# EAGLE schematic se8 (EAGLE 6.5.0)
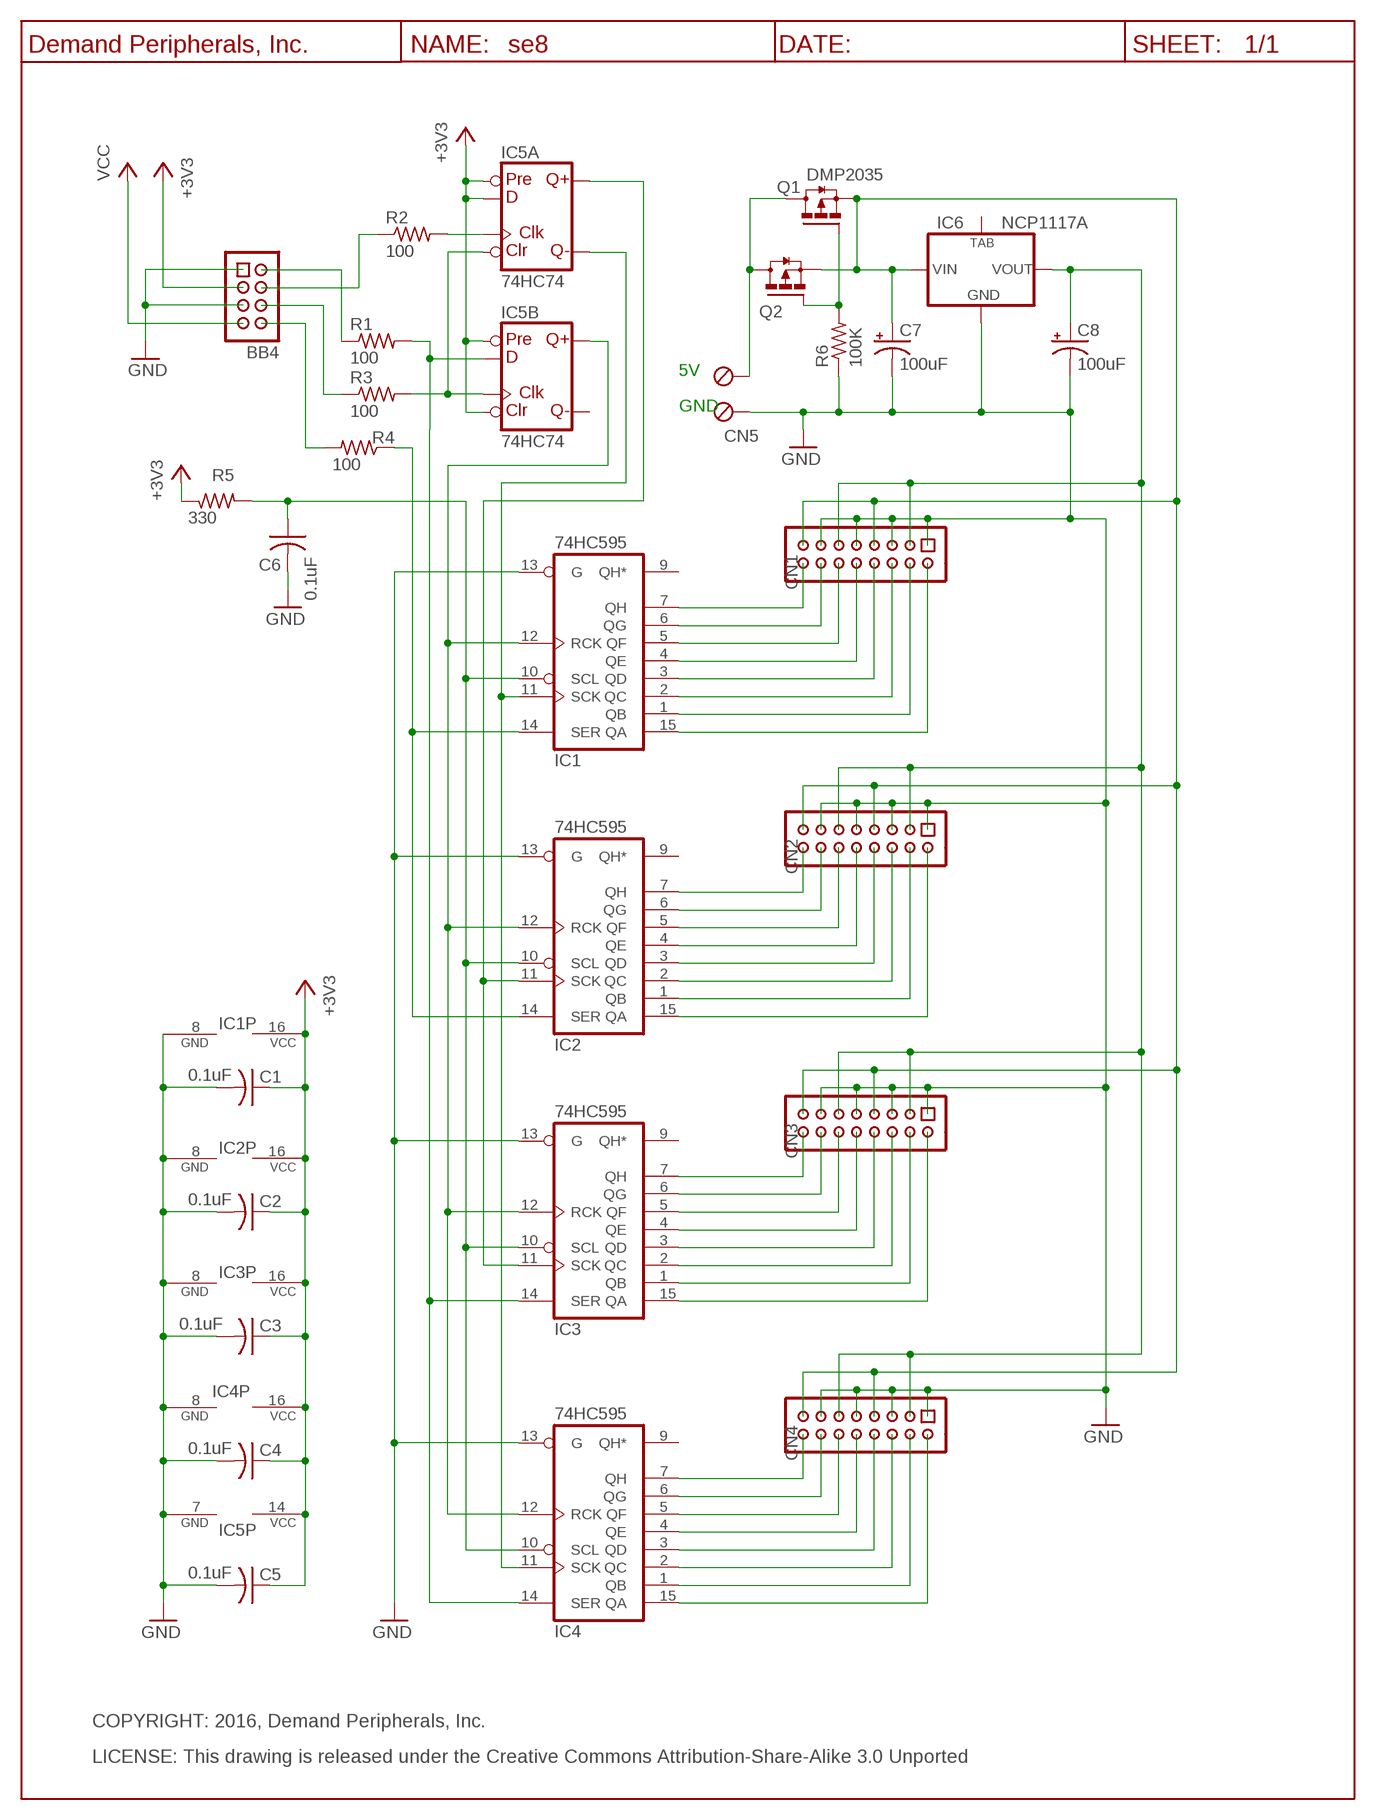
[diagram p0: schematic, sheet 1]

## Parts
BB4  BB4 Header  HDR-4X2-SHR  [HDR-4X2]
C1  0.1uF  C0.1UF_C0603  [C0603]
C2  0.1uF  C0.1UF_C0603  [C0603]
C3  0.1uF  C0.1UF_C0603  [C0603]
C4  0.1uF  C0.1UF_C0603  [C0603]
C5  0.1uF  C0.1UF_C0603  [C0603]
C6  0.1uF  C0.1UF_C0603  [C0603]
C7  100uF  C100UF35V_E3.5-8  [E3.5-8]
C8  100uF  C100UF35V_E3.5-8  [E3.5-8]
CN1  HDR-8X2-SHR  [HDR-8X2]
CN2  HDR-8X2-SHR  [HDR-8X2]
CN3  HDR-8X2-SHR  [HDR-8X2]
CN4  HDR-8X2-SHR  [HDR-8X2]
CN5  TBLK-5.08-X2  [TBLK-5.08-X2]
IC1  74HC595  74595  [SO16]
IC2  74HC595  74595  [SO16]
IC3  74HC595  74595  [SO16]
IC4  74HC595  74595  [SO16]
IC5  74HC74  74AHC74  [SO14]
IC6  NCP1117A  LM1117A  [SOT223]
Q1  DMP2035  [SOT23]
Q2  DMP2035  [SOT23]
R1  100  R100_R0603  [R0603]
R2  100  R100_R0603  [R0603]
R3  100  R100_R0603  [R0603]
R4  100  R100_R0603  [R0603]
R5  330  R330_R0603  [R0603]
R6  100K  R100K_R0603  [R0603]
U$2  DP_FRAME_P  [P_FRAME]

## Nets
+3V3: BB4.3 C1.1 C2.1 C3.1 C4.1 C5.1 IC1.16(VCC) IC2.16(VCC) IC3.16(VCC) IC4.16(VCC) IC5.2(A:D) IC5.4(A:PRE) IC5.10(B:PRE) IC5.13(B:CLR) IC5.14(P:VCC) R5.1
GND: BB4.1 BB4.5 C1.2 C2.2 C3.2 C4.2 C5.2 C6.2 C7.- C8.- CN1.1 CN1.5 CN1.9 CN1.13 CN2.1 CN2.5 CN2.9 CN2.13 CN3.1 CN3.5 CN3.9 CN3.13 CN4.1 CN4.5 CN4.9 CN4.13 CN5.1(KL) IC1.8(GND) IC1.13(G) IC2.8(GND) IC2.13(G) IC3.8(GND) IC3.13(G) IC4.8(GND) IC4.13(G) IC5.7(P:GND) IC6.1(GND) R6.1
N$1: BB4.8 R4.2
N$2: CN4.2 IC4.15(QA)
N$3: IC1.12(RCK) IC2.12(RCK) IC3.12(RCK) IC4.12(RCK) IC5.9(B:Q)
N$4: IC2.11(SCK) IC3.11(SCK) IC5.5(A:Q)
N$7: CN4.4 IC4.1(QB)
N$8: CN4.6 IC4.2(QC)
N$9: CN4.8 IC4.3(QD)
N$10: CN4.10 IC4.4(QE)
N$12: CN4.12 IC4.5(QF)
N$13: CN4.14 IC4.6(QG)
N$14: CN4.16 IC4.7(QH)
N$15: CN3.2 IC3.15(QA)
N$16: CN3.4 IC3.1(QB)
N$17: CN3.6 IC3.2(QC)
N$18: CN3.8 IC3.3(QD)
N$19: CN3.10 IC3.4(QE)
N$20: CN3.12 IC3.5(QF)
N$21: CN3.14 IC3.6(QG)
N$22: CN3.16 IC3.7(QH)
N$23: CN2.2 IC2.15(QA)
N$24: CN2.4 IC2.1(QB)
N$25: CN2.6 IC2.2(QC)
N$26: CN2.8 IC2.3(QD)
N$28: CN2.10 IC2.4(QE)
N$29: CN2.12 IC2.5(QF)
N$30: BB4.2 R1.1
N$31: CN2.14 IC2.6(QG)
N$32: CN2.16 IC2.7(QH)
N$34: IC5.3(A:CLK) R2.2
N$35: IC3.14(SER) IC4.14(SER) IC5.12(B:D) R1.2
N$36: IC5.1(A:CLR) IC5.11(B:CLK) R3.2
N$37: IC1.14(SER) IC2.14(SER) R4.1
N$38: BB4.6 R3.1
N$39: IC1.11(SCK) IC4.11(SCK) IC5.6(A:!Q)
N$41: BB4.4 R2.1
N$42: CN1.2 IC1.15(QA)
N$56: CN1.4 IC1.1(QB)
N$61: CN1.6 IC1.2(QC)
N$65: CN1.8 IC1.3(QD)
N$66: C6.1 IC1.10(SCL) IC2.10(SCL) IC3.10(SCL) IC4.10(SCL) R5.2
N$67: CN1.10 IC1.4(QE)
N$72: CN1.12 IC1.5(QF)
N$74: CN1.14 IC1.6(QG)
N$76: CN1.16 IC1.7(QH)
N$77: C7.+ CN1.7 CN1.15 CN2.7 CN2.15 CN3.7 CN3.15 CN4.7 CN4.15 IC6.3(IN) Q1.3(S) Q2.3(S)
N$79: CN5.2(KL1) Q1.2(D) Q2.2(D)
N$80: Q1.1(G) Q2.1(G) R6.2
N$82: C8.+ CN1.3 CN1.11 CN2.3 CN2.11 CN3.3 CN3.11 CN4.3 CN4.11 IC6.2(OUT)
VCC: BB4.7
Unconnected: IC1.9(QH*) IC2.9(QH*) IC3.9(QH*) IC4.9(QH*) IC5.8(B:!Q) IC6.4(TAB)

## Notes on the sheet
- 5V
- GND
- COPYRIGHT: 2016, Demand Peripherals, Inc.
- LICENSE: This drawing is released under the Creative Commons Attribution-Share-Alike 3.0 Unported

## Library data of the parts
BB4 = dpi-conn:HDR-4X2-SHR: Shrouded 4x2 pin header; VENDOR: Digikey; VENDOR-PART-NUM: 609-3530-ND
C1-C6 = dpi-passive:C0.1UF_: 0.1 uF Capacitor, 25V, X7R; VENDOR: Digikey; VENDOR-PART-NUM: 1276-1126-2-ND
C7 C8 = dpi-passive:C100UF35V_: 100uF polarized capacitor, 35 volts, general purpose; VENDOR: Digikey; VENDOR-PART-NUM: 399-6548-ND
CN1-CN4 = dpi-conn:HDR-8X2-SHR: Shrouded header, 8x2, 0.1 inch; VENDOR: Digikey; VENDOR-PART-NUM: S9171-ND
CN5 = dpi-conn:TBLK-5.08-X2: Terminal Block, 5.08mm, x2, screw terminals; VENDOR: Digikey; VENDOR-PART-NUM: ED2609-ND
IC1-IC4 = dpi-transic:74*595: 8-bit SHIFT REGISTER, output latch; VENDOR: Digikey; VENDOR-PART-NUM: 74HC595D(BJ)CT-ND
IC5 = dpi-transic:74AHC74: Dual D type positive edge triggered FLIP FLOP, preset and clear; VENDOR: Digikey; VENDOR-PART-NUM: 568-4458-1-ND
IC6 = dpi-transic:LM1117A: 3.3 volt linear regulator; VENDOR: Digikey; VENDOR-PART-NUM: NCP1117LPST33T3GOSCT-ND
Q1 Q2 = dpi-transic:DMP2035: PFET; VENDOR: Digikey; VENDOR-PART-NUM: DMP2035U-7DICT-ND
R1-R4 = dpi-passive:R100_: 100 Ohm resistor, 1%, 0.1 watt; VENDOR: Digikey; VENDOR-PART-NUM: 311-100HRTR-ND
R5 = dpi-passive:R330_: 330 Ohm resistor, 1%, 0.1 watt; VENDOR: Digikey; VENDOR-PART-NUM: 311-330HRTR-ND
R6 = dpi-passive:R100K_: 100K Resistor, 1%, 0.1 watt; VENDOR: Digikey; VENDOR-PART-NUM: 311-100KHRTR-ND
U$2 = dpi-sym:DP_FRAME_P: Portrait/Letter Document Frame